# EAGLE design schema esp01-chata (EAGLE 7.3.0)
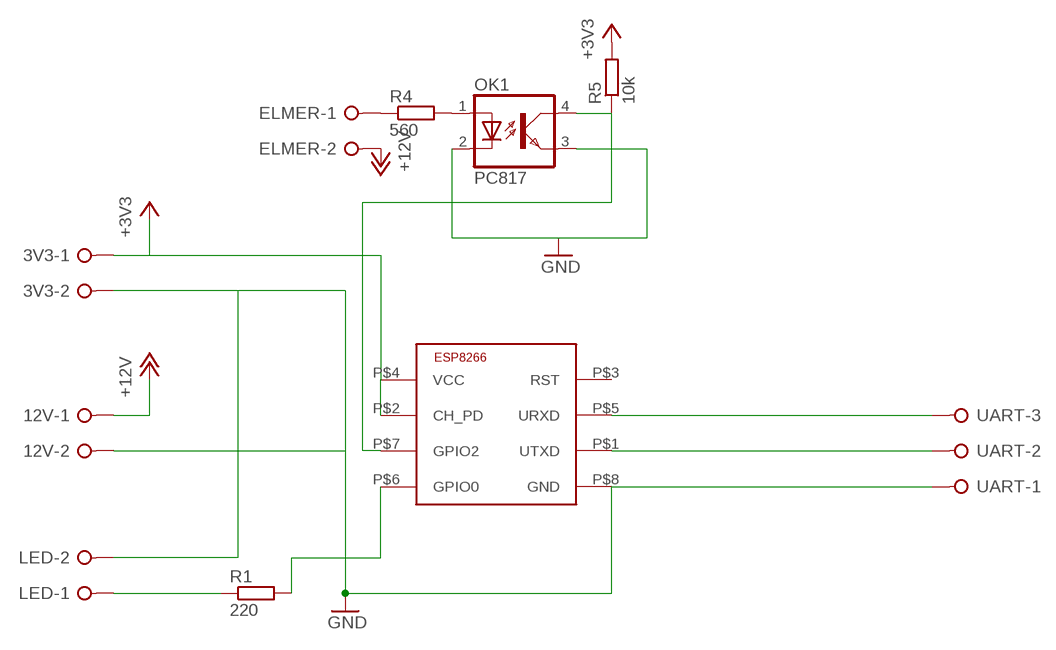
[diagram p0: schematic, sheet 1]

## Parts
3V3  W237-02P  [W237-132]
12V  W237-02P  [W237-132]
ELMER  W237-02P  [W237-132]
LED  W237-02P  [W237-132]
OK1  PC817  [DIL04]
R1  220  R-EU_0204/7  [0204/7]
R4  560  R-EU_0204/7  [0204/7]
R5  10k  R-EU_0204/7  [0204/7]
U$1  ESP8266-01  [ESP-01]
UART  W237-3E  [W237-3E]

## Nets
+3V3: 3V3.1 R5.2 U$1.P$2(CH_PD) U$1.P$4(VCC)
+12V: 12V.1 ELMER.2
GND: 3V3.2 12V.2 LED.2 OK1.2(C) OK1.3(EMIT) U$1.P$8(GND) UART.1
N$2: LED.1 R1.1
N$3: R1.2 U$1.P$6(GPIO0)
N$4: OK1.1(A) R4.2
N$5: U$1.P$5(URXD) UART.3
N$6: U$1.P$1(UTXD) UART.2
N$7: OK1.4(COL) R5.1 U$1.P$7(GPIO2)
N$8: ELMER.1 R4.1
Unconnected: U$1.P$3(RST)

## Library data of the parts
3V3 12V ELMER LED = con-wago-508:W237-02P: WAGO SREW CLAMP; OC_FARNELL: unknown; OC_NEWARK: unknown
OK1 = optocoupler:PC817: SHARP OPTO COUPLER; MPN: PC817X4J000F; OC_FARNELL: 9707727; OC_NEWARK: 97K7059
R1 R4 R5 = rcl:R-EU_: RESISTOR, European symbol
U$1 = ESP8266:ESP8266-01: ESP8266 - ESP-01 Module
UART = con-wago-508:W237-3E: WAGO SREW CLAMP; OC_FARNELL: unknown; OC_NEWARK: unknown

## Board
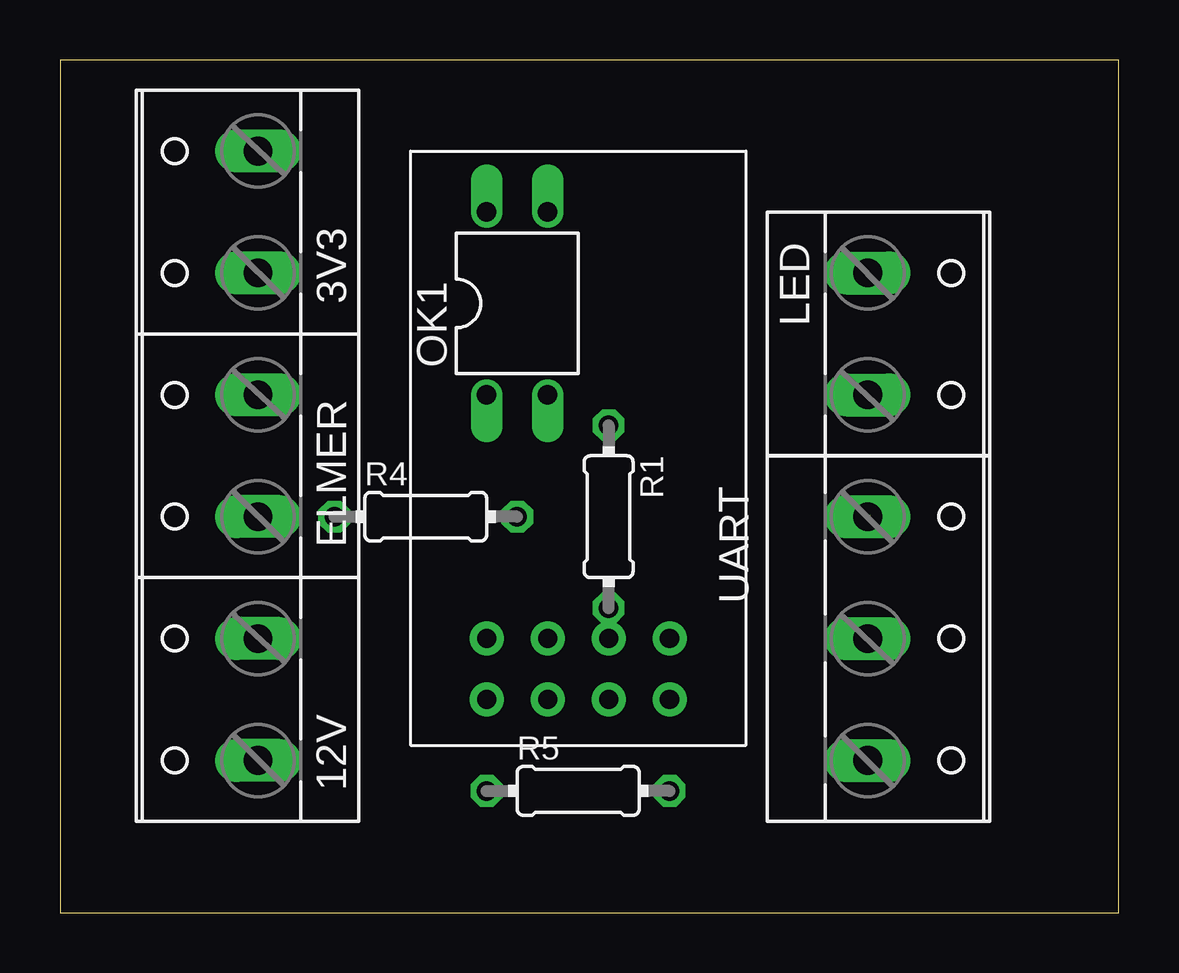
[diagram p1: board, top side]
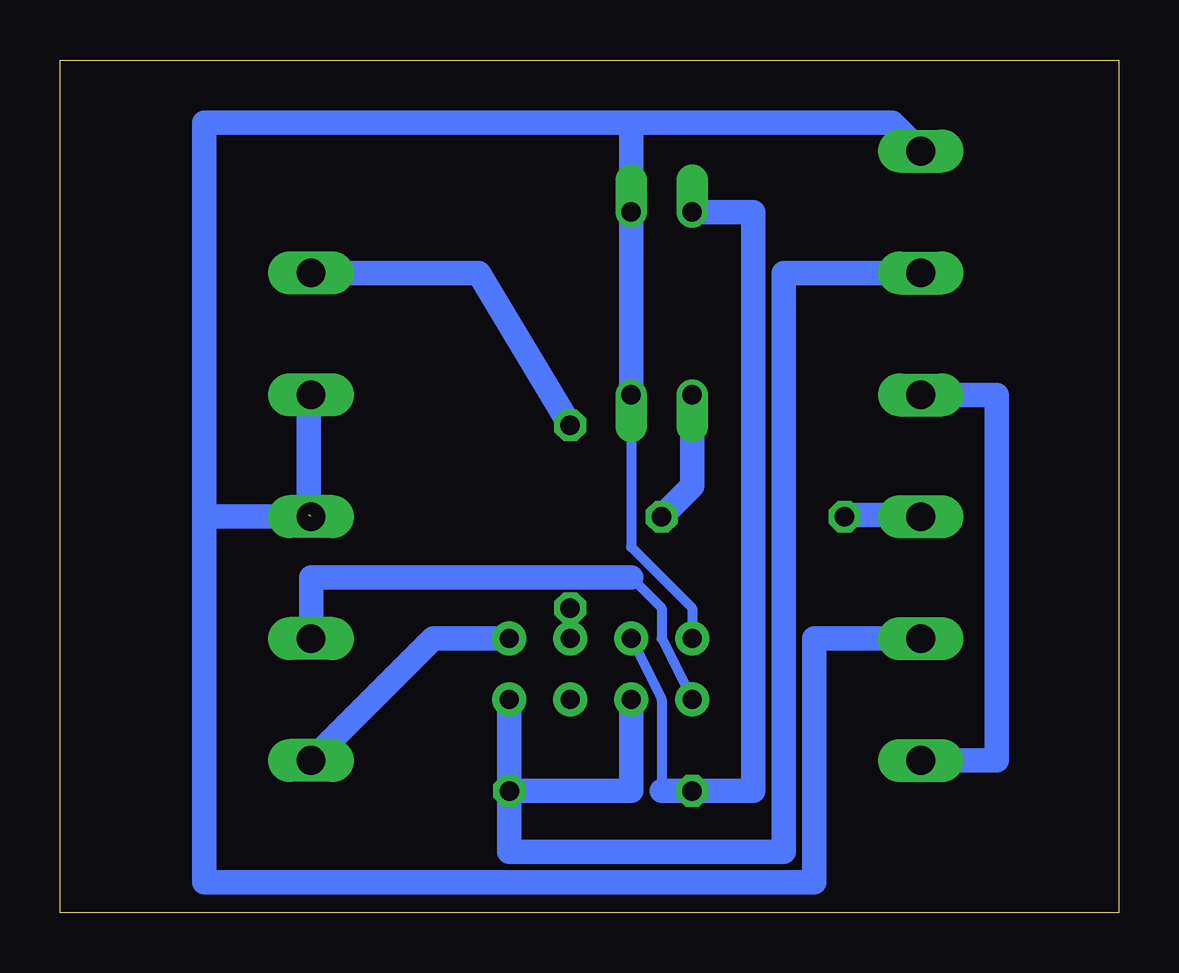
[diagram p2: board, bottom side, seen from below]

Size 44.12 x 35.55 mm. Coordinates in mm from the lower left corner, seen from the top.
Outline: 0,0 44.12,0 44.12,35.55 0,35.55 0,0
Copper layers (1*16): Top 0.035mm / dielectric 1.5mm / Bottom 0.035mm
Design rules "default": minimum track width 10mil, minimum drill 24mil, track to track 8mil, track to pad 8mil, pad to pad 8mil, via to via 8mil, smd to smd 8mil, copper to edge 40mil, drill to drill 8mil, minimum pad ring 10mil, minimum via ring 8mil, stop-mask expansion 4mil, vias tented up to drill 0mil, thermal gap 10mil

### Footprints (pad centres in the part's own frame; a part is rotated, then mirrored left to right if it is on the bottom)
W237-132 = drill 1.194 long: 1 -2.54,-0.635; 2 2.54,-0.635
DIL04 = drill 0.813 offset: 1 -1.27,-3.81; 2 1.27,-3.81; 3 1.27,3.81; 4 -1.27,3.81
0204/7 = drill 0.813 octagon: 1 -3.81,0; 2 3.81,0
ESP-01 = drill 0.8 pad 1.422: P$1 0,0; P$2 2.54,0; P$3 5.08,0; P$4 7.62,0; P$5 7.62,2.54; P$6 5.08,2.54; P$7 2.54,2.54; P$8 0,2.54
W237-3E = drill 1.194 long: 1 -5.08,-0.635; 2 0,-0.635; 3 5.08,-0.635

### Placement (x,y rotation side)
3V3  7.62,29.21 90 top
12V  7.62,8.89 90 top
ELMER  7.62,19.05 90 top
LED  34.29,24.13 270 top
OK1  19.05,25.4 0 top
R1  22.86,16.51 270 top
R4  15.24,16.51 0 top
R5  21.59,5.08 0 top
U$1  17.78,8.89 0 top
UART  34.29,11.43 270 top

### Tracks (layer width: path | path; a pad name or v marks a point on that pad's centre or on a via)
+3V3
  Bottom 1.016: R5.2 25.4,2.54 13.97,2.54 13.97,26.67 3V3.1 | R5.2 U$1.P$4 | R5.2 20.32,5.08 U$1.P$2
+12V
  Bottom 1.016: ELMER.2 5.08,21.59 5.08,6.35 12V.1
GND  (1 unrouted)
  Bottom 0.254: 33.76,21.39 LED.2
  Bottom 0.406: 33.76,21.49 LED.2 | OK1.2 20.32,15.24 17.78,12.7 U$1.P$8
  Bottom 1.016: 38.1,16.51 38.1,1.27 12.7,1.27 12.7,11.43 12V.2 | 38.1,16.51 UART.1 | 33.76,16.59 33.76,21.49 | 20.32,32.94 OK1.3 OK1.2 | 20.32,32.94 38.1,32.94 38.1,16.51 | 20.32,32.94 9.45,32.94 3V3.2
N$2
  Bottom 1.016: LED.1 26.67,26.67 R1.1
N$3
  Bottom 0.406: R1.2 U$1.P$6
N$4
  Bottom 1.016: OK1.1 17.78,17.78 R4.2
N$5
  Bottom 1.016: U$1.P$5 28.57,11.43 UART.3
N$6
  Bottom 0.406: 20.32,13.97 19.05,12.7 19.05,11.43 U$1.P$1
  Bottom 1.016: UART.2 33.66,13.97 20.32,13.97
N$7
  Bottom 0.406: U$1.P$7 19.05,8.89 19.05,5.08
  Bottom 1.016: 19.05,5.08 R5.1 15.24,5.08 15.24,29.21 OK1.4
N$8
  Bottom 0.254: 11.35,16.59 R4.1 | 8.38,16.59 ELMER.1
  Bottom 0.406: 8.26,16.59 ELMER.1
  Bottom 1.016: 11.35,16.59 8.26,16.59